# EAGLE schematic Ekran (EAGLE 9.7.0)
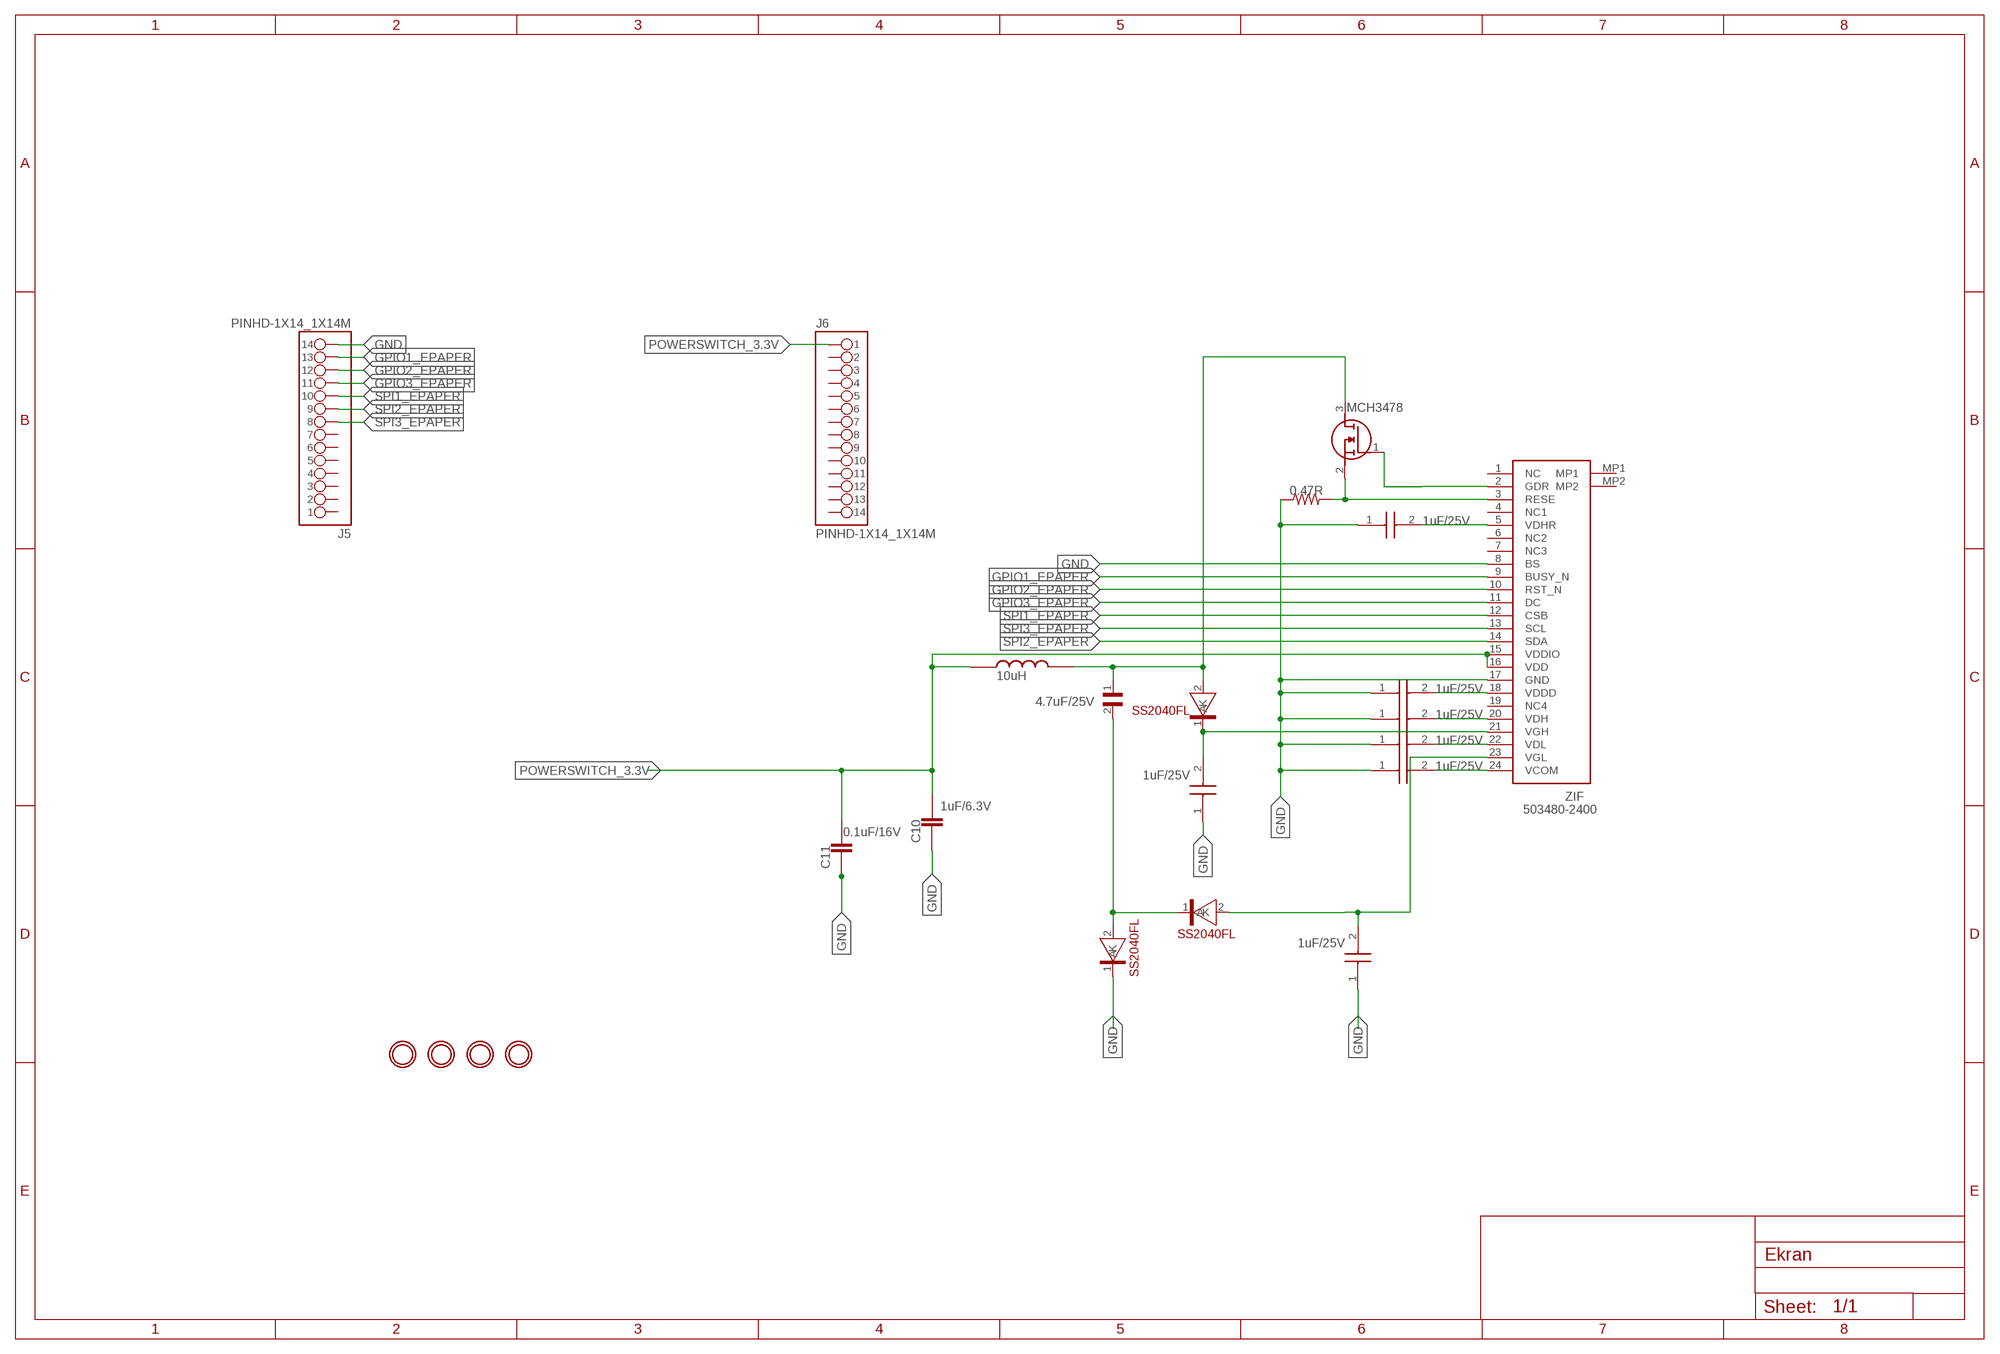
[diagram p0: schematic, sheet 1]

## Parts
C1  MAJCT168BB7105KTEA01  [MAJX16]
C2  MAJCT168BB7105KTEA01  [MAJX16]
C3  MAJCT168BB7105KTEA01  [MAJX16]
C4  MAJCT168BB7105KTEA01  [MAJX16]
C5  MAJCT168BB7105KTEA01  [MAJX16]
C6  MAJCT168BB7105KTEA01  [MAJX16]
C7  4.7uF/25V  C1210C475K3NACTU  [CAPC3225X280N]
C8  MAJCT168BB7105KTEA01  [MAJX16]
C10  1uF/6.3V  06036D105KAT4A  [CAPC1608X90]
C11  0.1uF/16V  06036D105KAT4A  [CAPC1608X90]
J5  PINHD-1X14_1X14M  [1X14]
J6  PINHD-1X14_1X14M  [1X14]
L2  10uH  LQM18DN100M70L  [INDC1608X95N]
Q1  MCH3478  MCH3478-TL-W  [SOTFL65P210X90-3N]
R1  0.47R  R-US_AXIAL-7.2MM-PITCH  [RESAD724W46L381D178B]
U$1  SS2040FL  [SOD-123FL]
U$2  SS2040FL  [SOD-123FL]
U$3  SS2040FL  [SOD-123FL]
U$4  MOUNTINGHOLE2.5  [MOUNTINGHOLE_2.5_PLATED]
U$5  MOUNTINGHOLE2.5  [MOUNTINGHOLE_2.5_PLATED]
U$6  MOUNTINGHOLE2.5  [MOUNTINGHOLE_2.5_PLATED]
U$7  MOUNTINGHOLE2.5  [MOUNTINGHOLE_2.5_PLATED]
ZIF  503480-2400  [5034802400]

## Nets
GND: C1.1 C2.1 C3.1 C4.1 C5.1 C6.1 C8.1 C10.1 C11.1 J5.14 R1.1 U$2.1(K) ZIF.8(BS) ZIF.17(GND)
GPIO1_EPAPER [New Class]: J5.13 ZIF.9(BUSY_N)
GPIO2_EPAPER: J5.12 ZIF.10(RST_N)
GPIO3_EPAPER [New Class]: J5.11 ZIF.11(DC)
N$1 [New Class]: Q1.1(G) ZIF.2(GDR)
N$2 [New Class]: C5.2 ZIF.5(VDHR)
N$3 [New Class]: C4.2 ZIF.18(VDDD)
N$5 [New Class]: C7.2 U$2.2(A) U$3.1(K)
N$12 [New Class]: C7.1 L2.2 Q1.3(D) U$1.2(A)
N$15 [New Class]: C1.2 ZIF.20(VDH)
N$16 [New Class]: C6.2 U$1.1(K) ZIF.21(VGH)
N$17 [New Class]: C2.2 ZIF.22(VDL)
N$18 [New Class]: C8.2 U$3.2(A) ZIF.23(VGL)
N$19 [New Class]: C3.2 ZIF.24(VCOM)
N$20 [New Class]: Q1.2(S) R1.2 ZIF.3(RESE)
POWERSWITCH_3.3V [New Class]: C10.2 C11.2 J6.1 L2.1 ZIF.15(VDDIO) ZIF.16(VDD)
SPI1_EPAPER [New Class]: J5.10 ZIF.12(CSB)
SPI2_EPAPER [New Class]: J5.9 ZIF.14(SDA)
SPI3_EPAPER [New Class]: J5.8 ZIF.13(SCL)
Unconnected: J5.1 J5.2 J5.3 J5.4 J5.5 J5.6 J5.7 J6.2 J6.3 J6.4 J6.5 J6.6 J6.7 J6.8 J6.9 J6.10 J6.11 J6.12 J6.13 J6.14 ZIF.1(NC) ZIF.4(NC1) ZIF.6(NC2) ZIF.7(NC3) ZIF.19(NC4) ZIF.MP1 ZIF.MP2

## Library data of the parts
C1-C6 C8 = MAJCT168BB7105KTEA01:MAJCT168BB7105KTEA01: MULTILAYER CERAMIC CAPACITORS[Multilayer Ceramic Capacitors (High dielectric type) for Automotive Powertrain and Safety (Cu external electrode products)] Source: Datasheet <https://ds.yuden.co.jp/TYCOMPAS/or/detail?pn=MAJCT168BB7105KTEA01>; DESCRIPTION: 1uF/25V; HEIGHT: 0.8mm; MANUFACTURER_NAME: TAIYO YUDEN; MANUFACTURER_PART_NUMBER: MAJCT168BB7105KTEA01
C7 = C1210C475K3NACTU:C1210C475K3NACTU: CAPACITOR, 4.7UF, 25V, 1210; Capacitor Application:Automotive Qualified; Dielectric Characteristic:X8L; Capacitance:4.7µF; Capacitance Tolerance:± 10%; Voltage Rating:25V; Capacitor Case Style:1210; Capacitor Mounting:SMD; Operating Temperature Range:-55°C to +150°C; SVHC:No SVHC (20-Jun-2011); External Depth:2.5mm; External Length / Height:2.5mm; External Width:3.2mm; No. of Pins:2; Series:MLCC; Temperature Coefficient:± 15% Check availability <https://pricing.snapeda.com/parts/C1210C475K3NACTU/KEMET/view-part?ref=eda>; AVAILABILITY: In Stock; CHECK_PRICES: https://www.snapeda.com/parts/C1210C475K3NACTU/KEMET/view-part/?ref=eda; DESCRIPTION: CAPACITOR, 4.7UF, 25V, 1210; Capacitor Application:Automotive Qualified; Dielectric Characteristic:X8L; Capacitance:4.7µF; Capacitance Tolerance:± 10%; Voltage Rating:25V; Capacitor Case Style:1210; Capacitor Mounting:SMD; Operating Temperature Range:-55°C to +150°C; SVHC:No SVHC (20-Jun-2011); External Depth:2.5mm; External Length / Height:2.5mm; External Width:3.2mm; No. of Pins:2; Series:MLCC; Temperature Coefficient:± 15%; MF: KEMET; MP: C1210C475K3NACTU; PACKAGE: 3225 KEMET; PRICE: None; SNAPEDA_LINK: https://www.snapeda.com/parts/C1210C475K3NACTU/KEMET/view-part/?ref=snap
C10 C11 = 06036D105KAT4A:06036D105KAT4A: Cap Ceramic 1uF 6.3V X5R 10% SMD 0603 85°C Paper T/R Check availability <https://pricing.snapeda.com/parts/06036D105KAT4A/KYOCERA%20AVX/view-part?ref=eda>; AVAILABILITY: Not in stock; CHECK_PRICES: https://www.snapeda.com/parts/06036D105KAT4A/Kyocera/view-part/?ref=eda; DESCRIPTION: CERAMIC CAPACITOR, 1UF, 6.3V, X5R, 10%, 0603, FULL REEL; Capacitance:1µF; Voltage(DC):6.3V; Capacitor Case / Package:0603 [1608 Metric]; Capacitance Tolerance:± 10%; Dielectric Characteristic:X5R; Product Range:-; Qualification:- RoHS Compliant: Yes; MF: KYOCERA AVX; MP: 06036D105KAT4A; PACKAGE: None; PRICE: None; PURCHASE-URL: https://www.snapeda.com/api/url_track_click_mouser/?unipart_id=12404603&manufacturer=KYOCERA AVX&part_name=06036D105KAT4A&search_term=1uf/6.3v; SNAPEDA_LINK: https://www.snapeda.com/parts/06036D105KAT4A/Kyocera/view-part/?ref=snap
J5 J6 = Tinkercad:PINHD-1X14
L2 = LQM18DN100M70L:LQM18DN100M70L: Inductor with Inductance 10uH Tol.+/-20% Package 0603 (1608) Check availability <https://pricing.snapeda.com/parts/LQM18DN100M70L/Murata%20Electronics/view-part?ref=eda>; AVAILABILITY: In Stock; CHECK_PRICES: https://www.snapeda.com/parts/LQM18DN100M70L/Murata/view-part/?ref=eda; DESCRIPTION: Inductor with Inductance 10uH Tol.+/-20% Package 0603 (1608); MF: Murata Electronics; MP: LQM18DN100M70L; PACKAGE: 0603 Murata; PRICE: None; SNAPEDA_LINK: https://www.snapeda.com/parts/LQM18DN100M70L/Murata/view-part/?ref=snap
Q1 = MCH3478-TL-W:MCH3478-TL-W: MCH3478-TL-W N-Channel MOSFET, 2 A, 30 V, 3-Pin MCHP ON Semiconductor Source: Datasheet <https://datasheet.datasheetarchive.com/originals/distributors/DKDS-17/338362.pdf>; DESCRIPTION: MCH3478-TL-W N-Channel MOSFET, 2 A, 30 V, 3-Pin MCHP ON Semiconductor; HEIGHT: 0.9mm; MANUFACTURER_NAME: onsemi; MANUFACTURER_PART_NUMBER: MCH3478-TL-W; MOUSER_PART_NUMBER: 863-MCH3478-TL-W; MOUSER_PRICE-STOCK: https://www.mouser.co.uk/ProductDetail/ON-Semiconductor/MCH3478-TL-W/?qs=IxCaM9nJKKXCvH6qZaCEBA%3D%3D
R1 = Resistor:R-US: Resistor Fixed - ANSI; CATEGORY: Resistor; SUB-CATEGORY: Fixed
U$1-U$3 = SS2040FL:SS2040FL: Check availability <https://pricing.snapeda.com/parts/SS2040FL/Panjit/view-part?ref=eda>; AVAILABILITY: In Stock; CHECK_PRICES: https://www.snapeda.com/parts/SS2040FL/Panjit/view-part/?ref=eda; DESCRIPTION: Schottky Diodes & Rectifiers GP/TR/13/RoHS/10K/SOD-123FL/SKY/SOD/SSM-20AAFL/SSM20FL-QI02/PJ///; MF: Panjit; MP: SS2040FL; PACKAGE: None; PRICE: None; SNAPEDA_LINK: https://www.snapeda.com/parts/SS2040FL/Panjit/view-part/?ref=snap
U$4-U$7 = microbuilder:MOUNTINGHOLE: Mounting Hole For #2 screws (0.086"/2.18mm width, 0.094"/2.4mm hole) use 2.5mm; BOM: EXCLUDE
ZIF = ZIFF:503480-2400: FFC & FPC Connectors 0.5mm FPC RA SMT Dual Contact 24Ckt Source: Datasheet <https://componentsearchengine.com/Datasheets/1/503480-2400.pdf>; DESCRIPTION: FFC & FPC Connectors 0.5mm FPC RA SMT Dual Contact 24Ckt; HEIGHT: 1.87mm; MANUFACTURER_NAME: Molex; MANUFACTURER_PART_NUMBER: 503480-2400; MOUSER_PART_NUMBER: 538-503480-2400; MOUSER_PRICE-STOCK: https://www.mouser.co.uk/ProductDetail/Molex/503480-2400?qs=OAhjpuo3Vu7efIoxFh9AOw%3D%3D